# EAGLE schematic 1.Soru (EAGLE 9.6.2)
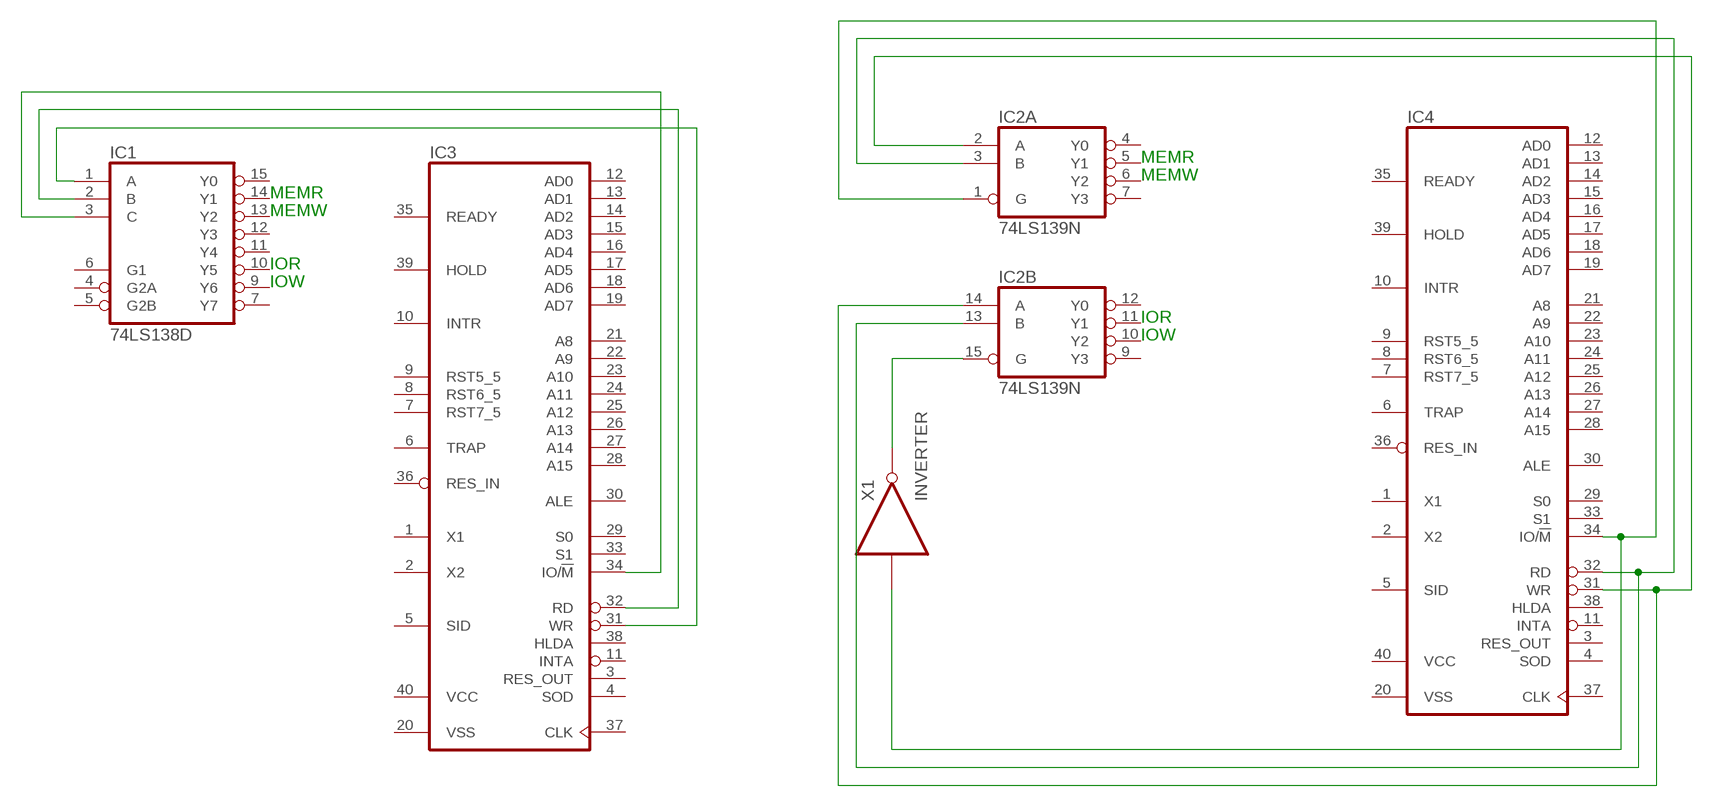
[diagram p0: schematic, sheet 1]

## Parts
IC1  74LS138D  [SO16]
IC2  74LS139N  [DIL16]
IC3  8085  [DIL40]
IC4  8085  [DIL40]
X1  INVERTER  (no package)

## Nets
N$1: IC1.3(C) IC3.34(IO/!M)
N$2: IC1.2(B) IC3.32(RD)
N$3: IC1.1(A) IC3.31(WR)
N$5: IC2.1(A:G) IC4.34(IO/!M) X1.I
N$6: IC2.3(A:B) IC2.13(B:B) IC4.32(RD)
N$7: IC2.2(A:A) IC2.14(B:A) IC4.31(WR)
N$8: IC2.15(B:G) X1.O
Unconnected: IC1.4(G2A) IC1.5(G2B) IC1.6(G1) IC1.7(Y7) IC1.9(Y6) IC1.10(Y5) IC1.11(Y4) IC1.12(Y3) IC1.13(Y2) IC1.14(Y1) IC1.15(Y0) IC2.4(A:Y0) IC2.5(A:Y1) IC2.6(A:Y2) IC2.7(A:Y3) IC2.9(B:Y3) IC2.10(B:Y2) IC2.11(B:Y1) IC2.12(B:Y0) IC3.1(X1) IC3.2(X2) IC3.3(RES_OUT) IC3.4(SOD) IC3.5(SID) IC3.6(TRAP) IC3.7(RST7_5) IC3.8(RST6_5) IC3.9(RST5_5) IC3.10(INTR) IC3.11(INTA) IC3.12(AD0) IC3.13(AD1) IC3.14(AD2) IC3.15(AD3) IC3.16(AD4) IC3.17(AD5) IC3.18(AD6) IC3.19(AD7) IC3.21(A8) IC3.22(A9) IC3.23(A10) IC3.24(A11) IC3.25(A12) IC3.26(A13) IC3.27(A14) IC3.28(A15) IC3.29(S0) IC3.30(ALE) IC3.33(S1) IC3.35(READY) IC3.36(RES_IN) IC3.37(CLK) IC3.38(HLDA) IC3.39(HOLD) IC4.1(X1) IC4.2(X2) IC4.3(RES_OUT) IC4.4(SOD) IC4.5(SID) IC4.6(TRAP) IC4.7(RST7_5) IC4.8(RST6_5) IC4.9(RST5_5) IC4.10(INTR) IC4.11(INTA) IC4.12(AD0) IC4.13(AD1) IC4.14(AD2) IC4.15(AD3) IC4.16(AD4) IC4.17(AD5) IC4.18(AD6) IC4.19(AD7) IC4.21(A8) IC4.22(A9) IC4.23(A10) IC4.24(A11) IC4.25(A12) IC4.26(A13) IC4.27(A14) IC4.28(A15) IC4.29(S0) IC4.30(ALE) IC4.33(S1) IC4.35(READY) IC4.36(RES_IN) IC4.37(CLK) IC4.38(HLDA) IC4.39(HOLD)

## Notes on the sheet
- MEMR̅
- MEMW̅
- MEMR̅
- MEMW̅
- IOR̅
- IOW̅
- IOR̅
- IOW̅

## Power pins joined to a net without a drawn wire
GND: IC1.8(GND) IC2.8(P:GND)
VCC: IC1.16(VCC) IC2.16(P:VCC) IC3.40(VCC) IC4.40(VCC)
VSS: IC3.20(VSS) IC4.20(VSS)

## Library data of the parts
IC1 = 74xx-eu:74*138: 3-line to 8-line DECODER/DEMULTIPLEXER
IC2 = 74xx-eu:74*139: Dual 2-line to 4-line DECODER/DEMULTIPLEXER
IC3 IC4 = micro-intel:8085: MICROCOMPUTER/PERIPHERAL DEVICE; OC_FARNELL: unknown; OC_NEWARK: unknown
X1 = ngspice-digital:INVERTER: logic inverter (NOT gate)